# Altium schematic sheet Pyros.SchDoc
size A; SheetNumber: 7; SheetTotal: 7
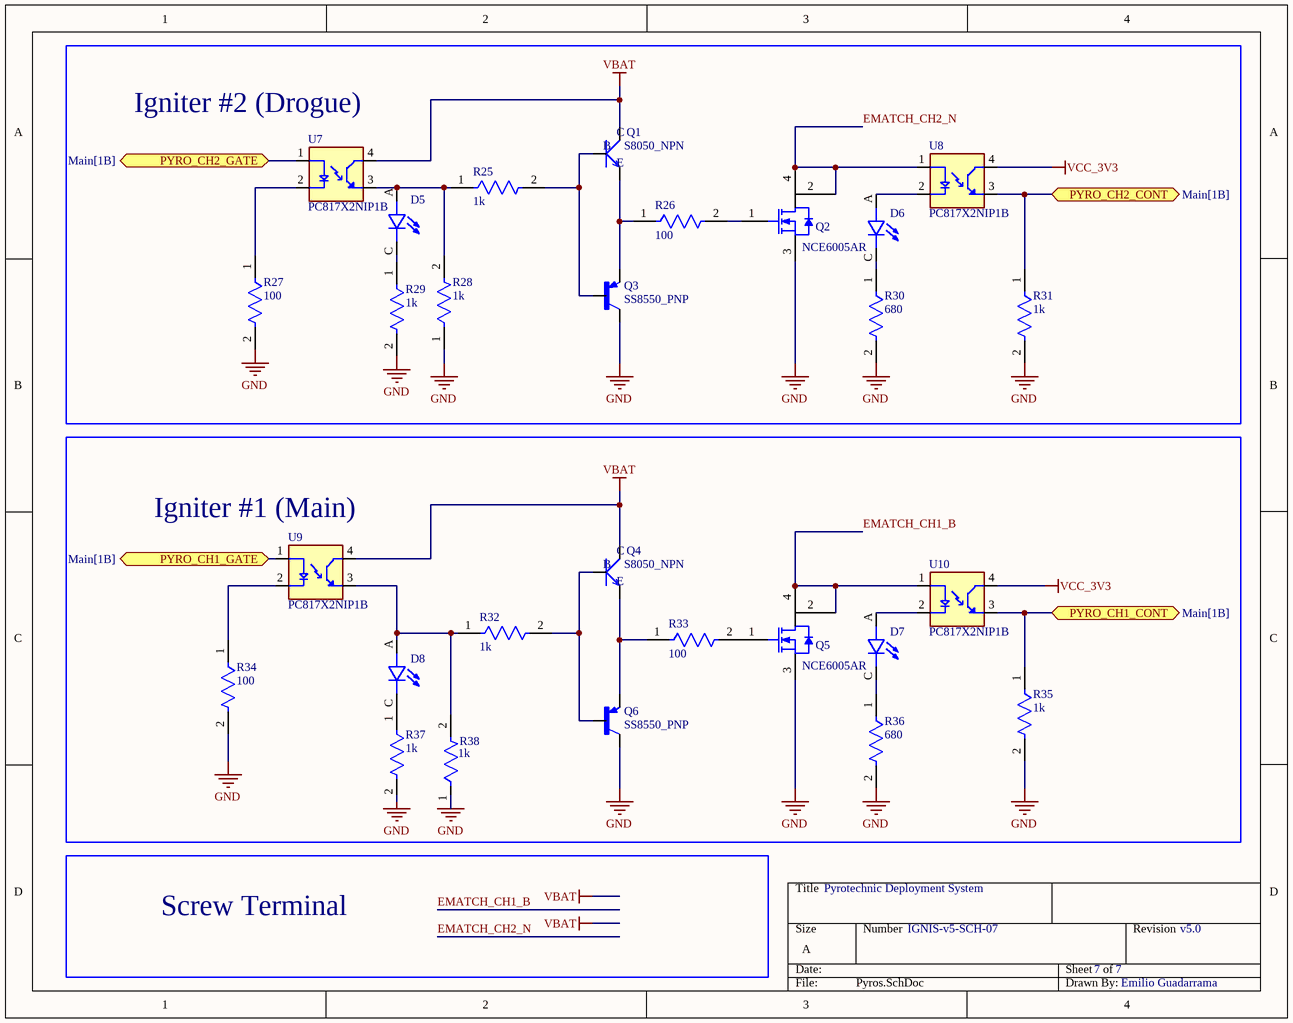
[diagram p0: Pyros.SchDoc]

## Parts
D5  SML-LXT0805IW-TR  [LEDC2012X120N]  (value not drawn)
D6  SML-LXT0805IW-TR  [LEDC2012X120N]  (value not drawn)
D7  SML-LXT0805IW-TR  [LEDC2012X120N]  (value not drawn)
D8  SML-LXT0805IW-TR  [LEDC2012X120N]  (value not drawn)
Q1  S8050_NPN  [SOT-23]
Q2  NCE6005AR  [PCBComponent_1]
Q3  SS8550_PNP  [SOT95P252X140-3N]
Q4  S8050_NPN  [SOT-23]
Q5  NCE6005AR  [PCBComponent_1]
Q6  SS8550_PNP  [SOT95P252X140-3N]
R25  1k  [FP-MCT0603-IPC_A]
R26  100  [FP-MCT0603-IPC_A]
R27  100  [FP-MCT0603-IPC_A]
R28  1k  [FP-MCT0603-IPC_A]
R29  1k  [FP-MCT0603-IPC_A]
R30  680  [FP-MCT0603-IPC_A]
R31  1k  [FP-MCT0603-IPC_A]
R32  1k  [FP-MCT0603-IPC_A]
R33  100  [FP-MCT0603-IPC_A]
R34  100  [FP-MCT0603-IPC_A]
R35  1k  [FP-MCT0603-IPC_A]
R36  680  [FP-MCT0603-IPC_A]
R37  1k  [FP-MCT0603-IPC_A]
R38  1k  [FP-MCT0603-IPC_A]
U7  PC817X2NIP1B  [SOIC254P960X420-4N]
U8  PC817X2NIP1B  [SOIC254P960X420-4N]
U9  PC817X2NIP1B  [SOIC254P960X420-4N]
U10  PC817X2NIP1B  [SOIC254P960X420-4N]

## Blocks framed on the sheet
Igniter #2 (Drogue): D5 D6 Q1-Q3 R25-R31 U7 U8
Igniter #1 (Main): D7 D8 Q4-Q6 R32-R38 U9 U10

## Ports
PYRO_CH1_CONT (bidir, see Main[1B]), PYRO_CH1_GATE (bidir, see Main[1B]), PYRO_CH2_CONT (bidir, see Main[1B]), PYRO_CH2_GATE (bidir, see Main[1B])

## Nets
GND: Q2.3(S) Q3.3(C) Q5.3(S) Q6.3(C) R27.2 R28.1 R29.2 R30.2 R31.2 R34.2 R35.2 R36.2 R37.2 R38.1
VBAT: Q1.3(C) Q4.3(C) U7.4(CT) U9.4(CT)
VCC_3V3: U8.4(CT) U10.4(CT)
EMATCH_CH1_B: Q5.2(D) Q5.4(D) U10.1(A)
EMATCH_CH2_N: Q2.2(D) Q2.4(D) U8.1(A)
PYRO_CH1_CONT: R35.1 U10.3(ET) ; port PYRO_CH1_CONT
PYRO_CH1_GATE: U9.1(A) ; port PYRO_CH1_GATE
PYRO_CH2_CONT: R31.1 U8.3(ET) ; port PYRO_CH2_CONT
PYRO_CH2_GATE: U7.1(A) ; port PYRO_CH2_GATE
NetD5_A: D5.A R25.1 R28.2 U7.3(ET)
NetD5_C: D5.C R29.1
NetD6_A: D6.A U8.2(C)
NetD6_C: D6.C R30.1
NetD7_A: D7.A U10.2(C)
NetD7_C: D7.C R36.1
NetD8_A: D8.A R32.1 R38.2 U9.3(ET)
NetD8_C: D8.C R37.1
NetQ1_1: Q1.1(B) Q3.1(B) R25.2
NetQ1_2: Q1.2(E) Q3.2(E) R26.1
NetQ2_1: Q2.1(G) R26.2
NetQ4_1: Q4.1(B) Q6.1(B) R32.2
NetQ4_2: Q4.2(E) Q6.2(E) R33.1
NetQ5_1: Q5.1(G) R33.2
NetR27_1: R27.1 U7.2(C)
NetR34_1: R34.1 U9.2(C)

## Notes on the sheet
- Pyrotechnic Deployment System
- Screw Terminal
- IGNIS-v5-SCH-07
- 7
- v5.0
- Emilio Guadarrama

## Library data of the parts
D5-D8 = SML-LXT0805IW-TR: LED;Red;11mcd;0.061In.Dia.;SMD;100mA;2V Vf;635nm;140deg;SMD;White Diffused;5V Vr | Lumex SML-LXT0805IW-TR; MF: Lumex Opto/Components; SnapEDA_Link: https://www.snapeda.com/parts/SML-LXT0805IW-TR/Lumex+Opto%252FComponents+Inc./view-part/?ref=snap; Package: 0805 Lumex; Value: *; MP: SML-LXT0805IW-TR; Check_prices: https://www.snapeda.com/parts/SML-LXT0805IW-TR/Lumex+Opto%252FComponents+Inc./view-part/?ref=eda
Q1 Q4 = SMD-TRANSISTORS-NPN-25V-500MW(SOT-23): Bipolar (BJT) Transistor NPN 25 V 500 mA 150MHz 300 mW Surface Mount SOT-23; MF: UMW; MP: S8050; Purchase-URL: https://pricing.snapeda.com/search/part/S8050/?ref=eda; Check_prices: https://www.snapeda.com/parts/S8050/Umwelt+Sensor+Teknik/view-part/?ref=eda; SnapEDA_Link: https://www.snapeda.com/parts/S8050/Umwelt+Sensor+Teknik/view-part/?ref=snap; Price: None; Availability: In Stock; Package: None; Value: *
Q3 Q6 = SS8550: Bipolar (BJT) Transistor PNP 25 V 1.5 A 100MHz 300 mW Surface Mount SOT-23; MF: MDD; SnapEDA_Link: https://www.snapeda.com/parts/SS8550/MDD/view-part/?ref=snap; Package: SOT-23-3 MDD; Value: *; MP: SS8550; Check_prices: https://www.snapeda.com/parts/SS8550/MDD/view-part/?ref=eda
R25 R28 R31 R32 R35 R38 = CMP-02407-011165-1: RES SMD 100 OHM 1% 1/8W 0603; Temperature Coefficient: 25ppm/°C; Resistance: 1kR; Power Rating: 125mW; Tolerance: 0.1%; Voltage Rating: 75V; Length: 1.55mm; Case Code (Imperial): 0603; Case/Package: 0603; Construction: Rectangular; Package Quantity: 1000; Number of Terminations: 2; Termination: SMD/SMT; Resistor Type: Thin Film; Features: Automotive AEC-Q200; Series: MCT 0603 - Precision; Max Operating Temperature: 155°C; Depth: 0.85mm; Max Power Dissipation: 125mW; Min Operating Temperature: -55°C; Width: 0.033inch; Case Code (Metric): 1608; Packaging: Tape and Reel; Weight: 6.7E-05oz; Military Standard: Not; Height: 0.022inch
R26 R33 = CMP-02407-011165-1: RES SMD 100 OHM 1% 1/8W 0603; Temperature Coefficient: 25ppm/°C; Resistance: 100R; Power Rating: 125mW; Tolerance: 0.1%; Voltage Rating: 75V; Length: 1.55mm; Case Code (Imperial): 0603; Case/Package: 0603; Construction: Rectangular; Package Quantity: 1000; Number of Terminations: 2; Termination: SMD/SMT; Resistor Type: Thin Film; Features: Automotive AEC-Q200; Series: MCT 0603 - Precision; Max Operating Temperature: 155°C; Depth: 0.85mm; Max Power Dissipation: 125mW; Min Operating Temperature: -55°C; Width: 0.033inch; Case Code (Metric): 1608; Packaging: Tape and Reel; Weight: 6.7E-05oz; Military Standard: Not; Height: 0.022inch
R27 R29 R34 R37 = CMP-02407-011165-1: RES SMD 100 OHM 1% 1/8W 0603; Temperature Coefficient: 25ppm/°C; Resistance: 150R; Power Rating: 125mW; Tolerance: 0.1%; Voltage Rating: 75V; Length: 1.55mm; Case Code (Imperial): 0603; Case/Package: 0603; Construction: Rectangular; Package Quantity: 1000; Number of Terminations: 2; Termination: SMD/SMT; Resistor Type: Thin Film; Features: Automotive AEC-Q200; Series: MCT 0603 - Precision; Max Operating Temperature: 155°C; Depth: 0.85mm; Max Power Dissipation: 125mW; Min Operating Temperature: -55°C; Width: 0.033inch; Case Code (Metric): 1608; Packaging: Tape and Reel; Weight: 6.7E-05oz; Military Standard: Not; Height: 0.022inch
R30 R36 = CMP-02407-011165-1: RES SMD 100 OHM 1% 1/8W 0603; Temperature Coefficient: 25ppm/°C; Resistance: 680R; Power Rating: 125mW; Tolerance: 0.1%; Voltage Rating: 75V; Length: 1.55mm; Case Code (Imperial): 0603; Case/Package: 0603; Construction: Rectangular; Package Quantity: 1000; Number of Terminations: 2; Termination: SMD/SMT; Resistor Type: Thin Film; Features: Automotive AEC-Q200; Series: MCT 0603 - Precision; Max Operating Temperature: 155°C; Depth: 0.85mm; Max Power Dissipation: 125mW; Min Operating Temperature: -55°C; Width: 0.033inch; Case Code (Metric): 1608; Packaging: Tape and Reel; Weight: 6.7E-05oz; Military Standard: Not; Height: 0.022inch
U7-U10 = PC817X2NIP1B: Optocoupler DC-IN 1-CH Transistor DC-OUT 4-Pin DIP SMD T/R; MF: Sharp Microelectronics; SnapEDA_Link: https://www.snapeda.com/parts/PC817X2NIP1B/Sharp+Microelectronics/view-part/?ref=snap; Package: SMD-4 Sharp Microelectronics; Value: *; MP: PC817X2NIP1B; Check_prices: https://www.snapeda.com/parts/PC817X2NIP1B/Sharp+Microelectronics/view-part/?ref=eda